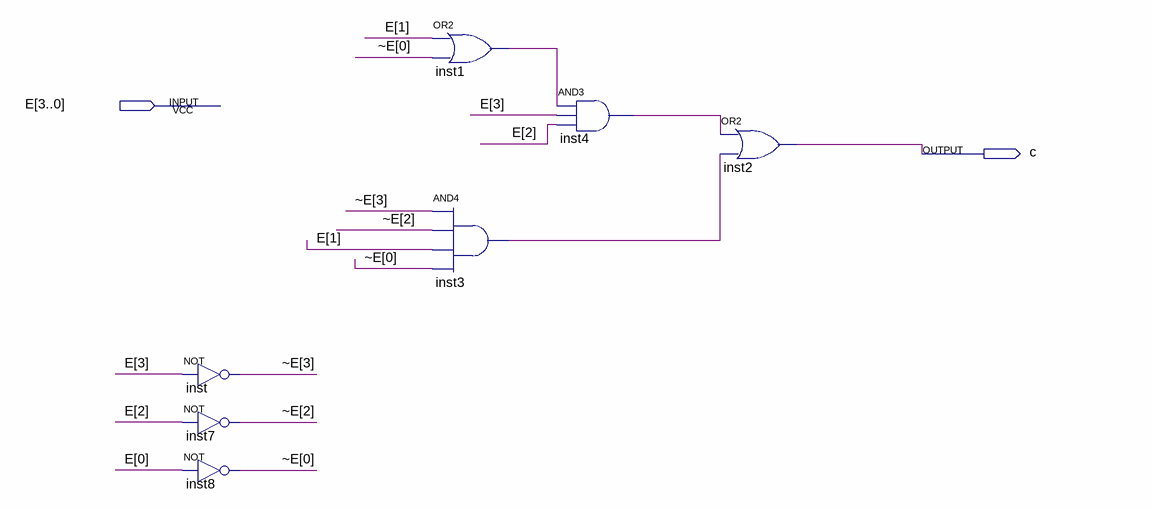
[diagram p0: schematic sheet]
// Quartus schematic bcd_ledC.bdf as structural Verilog: 7 symbols, 2 pins
module bcd_ledC (
  input  [3:0] E,
  output c
);

  wire inst1_out, inst3_out, inst4_out;
  wire [3:0] \~E ;

  not inst (\~E [3], E[3]);
  not inst7 (\~E [2], E[2]);
  not inst8 (\~E [0], E[0]);
  or inst1 (inst1_out, E[1], \~E [0]);
  and inst3 (inst3_out, \~E [3], \~E [2], E[1], \~E [0]);
  and inst4 (inst4_out, inst1_out, E[3], E[2]);
  or inst2 (c, inst4_out, inst3_out);
endmodule
